# Altium schematic sheet power_unit.SchDoc
size A4
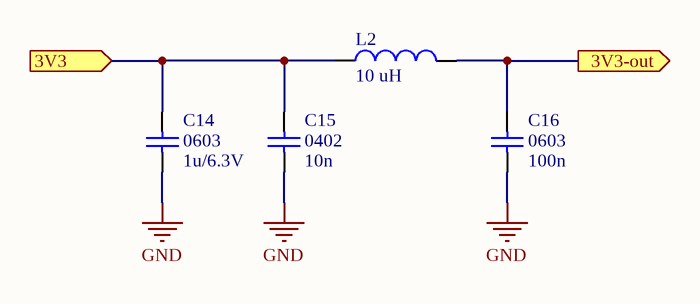
[diagram p0: power_unit.SchDoc]

## Parts
C14  0603  value 1u/6.3V  [SMD_Capacitor_0603]
C15  0402  value 10n  [SMD_Capacitor_0402]
C16  0603  value 100n  [SMD_Capacitor_0603]
L2  10 uH  [SMD_Resistor_0603]

## Ports
3V3 (in), 3V3-out (out)

## Nets
GND: C14.1 C15.1 C16.1
3V3: C14.2 C15.2 L2.1 ; port 3V3
3V3-out: C16.2 L2.2 ; port 3V3-out

## Notes on the sheet
- Title:
- Sheet:
- of
- Author:
- Model:
- Document Number:
- Checked by:
- Iss-Rev:
- Approved by:
- Date:
- File name:

## Library data of the parts
C14-C16 = Cap: Capacitor; Published: 8-Jun-2000; LatestRevisionDate: 17-Jul-2002; LatestRevisionNote: Re-released for DXP Platform.; PackageReference: RAD-0.3; Publisher: Altium Limited; PackageDescription: Radial Cap, Thru-Hole; 2 Leads; 0.3 in Pin Spacing
L2 = Inductor: Code_IEC: 1005; Published: 8-Jun-2000; LatestRevisionDate: 29-May-2009; LatestRevisionNote: IPC-7351 Footprint Added.; PackageReference: 0402-A; Publisher: Altium Limited; PackageDescription: Chip Inductor; Code_JEITA: 0402